# EAGLE design ASM4008 (EAGLE 9.6.2)
DATABASE: ./../../../../../Components/TinyCircuits_Part_Database.txt

## Sheet 1 of 2
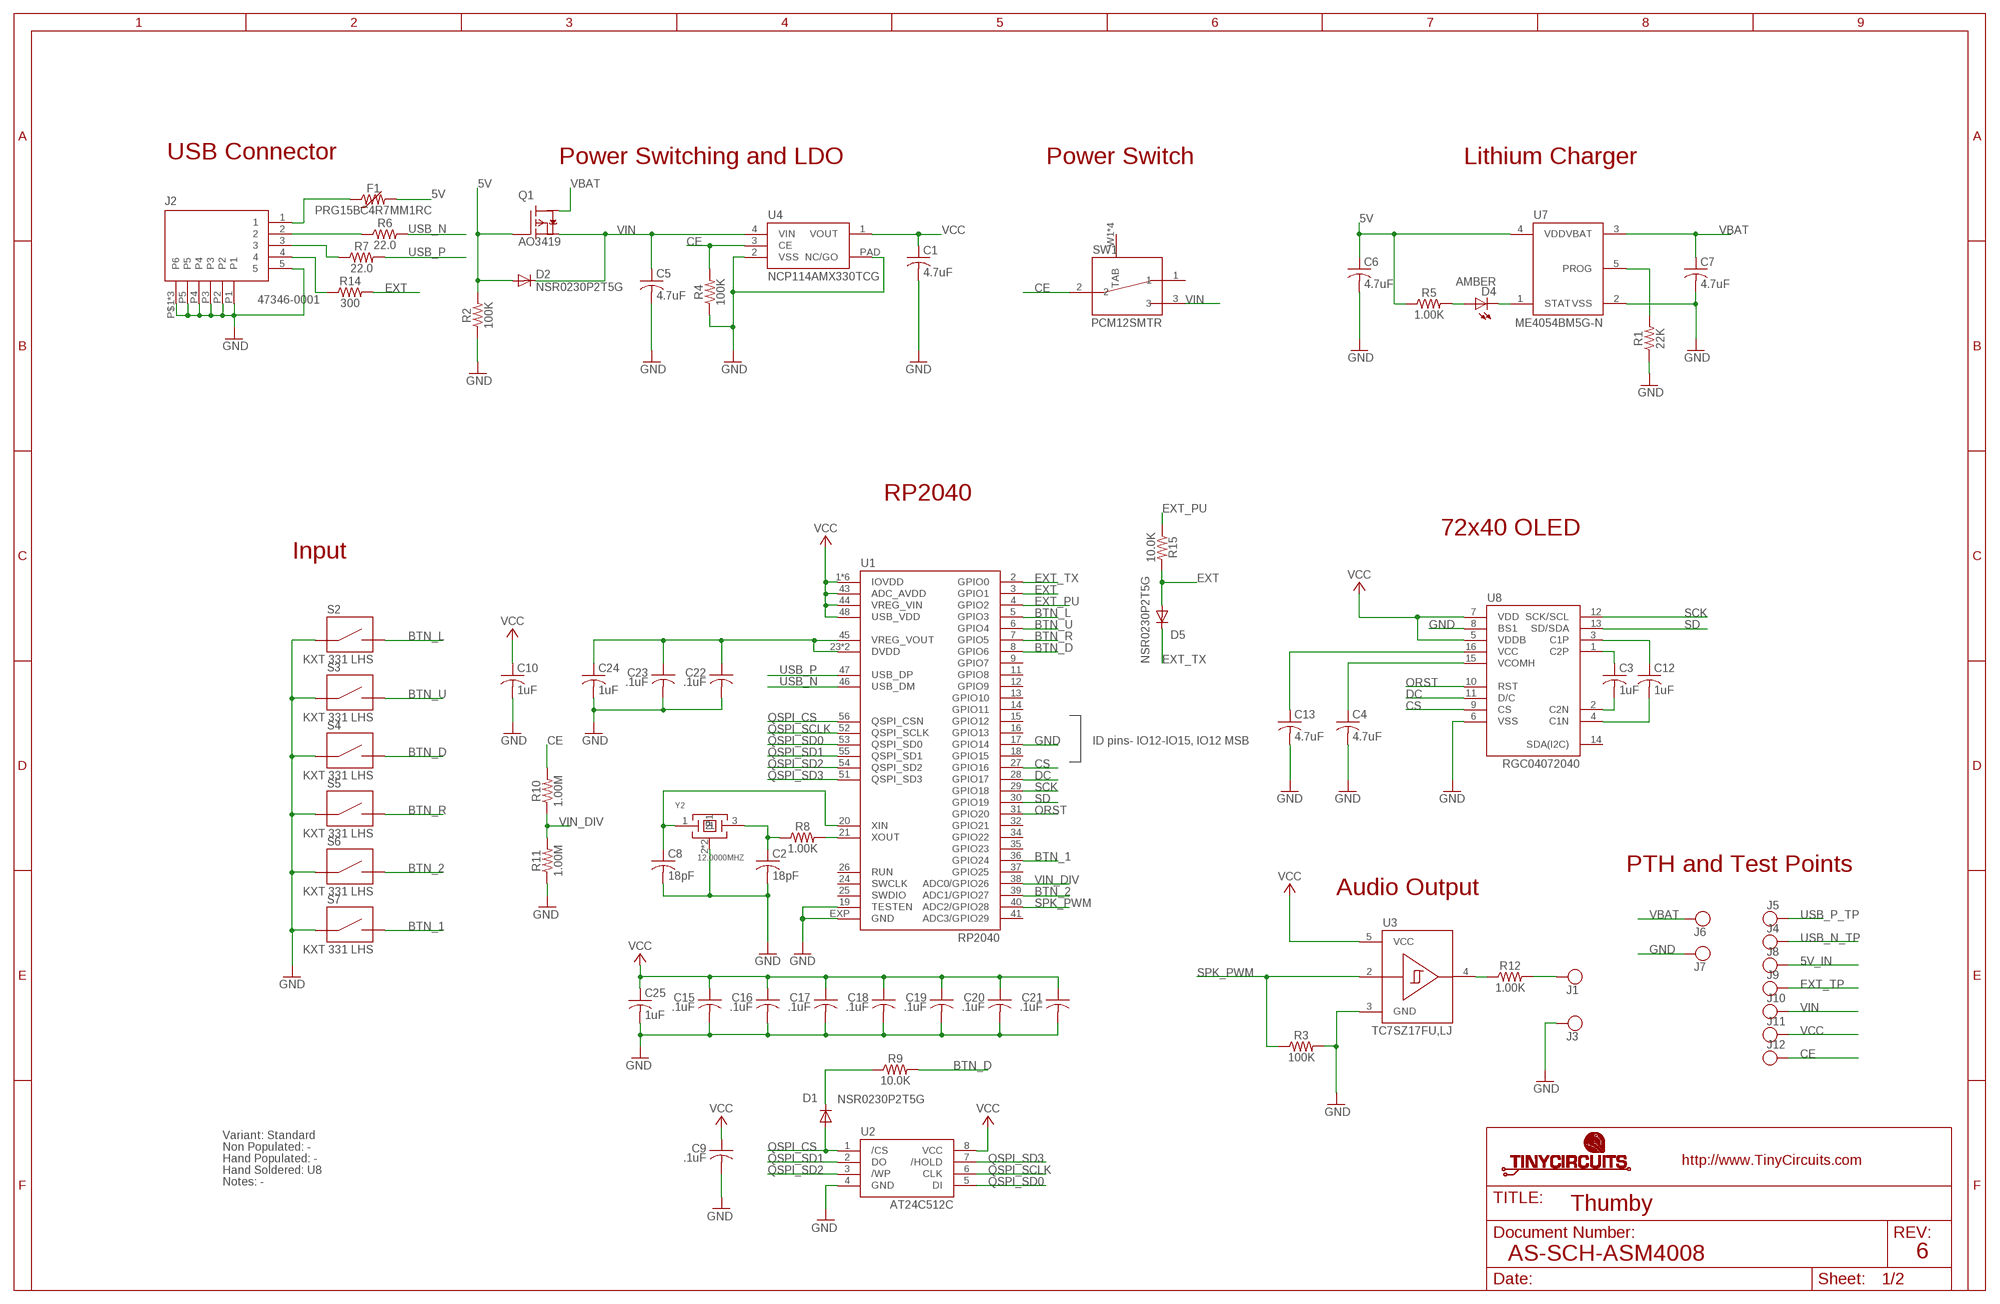
[diagram p0: schematic, sheet 1]

### Parts
C1  4.7uF  AS-ITM-00242  [C0402]
C2  18pF  AS-ITM-00121  [C0402]
C3  1uF  AS-ITM-00347  [C0603]
C4  4.7uF  AS-ITM-00632  [C0603]
C5  4.7uF  AS-ITM-00242  [C0402]
C6  4.7uF  AS-ITM-00242  [C0402]
C7  4.7uF  AS-ITM-00242  [C0402]
C8  18pF  AS-ITM-00121  [C0402]
C9  .1uF  AS-ITM-00008  [C0402]
C10  1uF  AS-ITM-00347  [C0603]
C12  1uF  AS-ITM-00347  [C0603]
C13  4.7uF  AS-ITM-00632  [C0603]
C15  .1uF  AS-ITM-00008  [C0402]
C16  .1uF  AS-ITM-00008  [C0402]
C17  .1uF  AS-ITM-00008  [C0402]
C18  .1uF  AS-ITM-00008  [C0402]
C19  .1uF  AS-ITM-00008  [C0402]
C20  .1uF  AS-ITM-00008  [C0402]
C21  .1uF  AS-ITM-00008  [C0402]
C22  .1uF  AS-ITM-00008  [C0402]
C23  .1uF  AS-ITM-00008  [C0402]
C24  1uF  AS-ITM-00105  [C0402]
C25  1uF  AS-ITM-00105  [C0402]
D1  NSR0230P2T5G  AS-ITM-00633L  [SOD-923L]
D2  NSR0230P2T5G  AS-ITM-00633L  [SOD-923L]
D4  AMBER  AS-ITM-00058  [0402_LED]
D5  NSR0230P2T5G  AS-ITM-00633L  [SOD-923L]
F1  PRG15BC4R7MM1RC  AS-ITM-00642  [0402]
J1  2336713-2  AS-ITM-00635  [2336713-2]
J2  47346-0001  AS-ITM-00629  [MICRO_USB_TABS]
J3  2336713-2  AS-ITM-00635  [2336713-2]
J4  TEST_POINT  [TEST_POINT_1MM]
J5  TEST_POINT  [TEST_POINT_1MM]
J6  PIN_1X.1"  [1X.1"]
J7  PIN_1X.1"  [1X.1"]
J8  TEST_POINT  [TEST_POINT_1MM]
J9  TEST_POINT  [TEST_POINT_1MM]
J10  TEST_POINT  [TEST_POINT_1MM]
J11  TEST_POINT  [TEST_POINT_1MM]
J12  TEST_POINT  [TEST_POINT_1MM]
Q1  AO3419  AS-ITM-00643A  [SOT23A]
R1  22K  AS-ITM-00147  [0402]
R2  100K  AS-ITM-00004  [0402]
R3  100K  AS-ITM-00004  [0402]
R4  100K  AS-ITM-00004  [0402]
R5  1.00K  AS-ITM-00003  [0402]
R6  22.0  AS-ITM-00025  [0402]
R7  22.0  AS-ITM-00025  [0402]
R8  1.00K  AS-ITM-00003  [0402]
R9  10.0K  AS-ITM-00032  [0402]
R10  1.00M  AS-ITM-00005  [0402]
R11  1.00M  AS-ITM-00005  [0402]
R12  1.00K  AS-ITM-00003  [0402]
R14  300  AS-ITM-00016  [0402]
R15  10.0K  AS-ITM-00032  [0402]
S2  KXT 331 LHS  AS-ITM-00640  [KXT_LHS_1]
S3  KXT 331 LHS  AS-ITM-00640  [KXT_LHS_1]
S4  KXT 331 LHS  AS-ITM-00640  [KXT_LHS_1]
S5  KXT 331 LHS  AS-ITM-00640  [KXT_LHS_1]
S6  KXT 331 LHS  AS-ITM-00640  [KXT_LHS_1]
S7  KXT 331 LHS  AS-ITM-00640  [KXT_LHS_1]
SW1  PCM12SMTR  AS-ITM-00220B  [PCM12SMTR_THUMBY]
U1  RP2040  AS-ITM-00611  [QFN56_0.4]
U2  AT24C512C  AS-ITM-00628N  [UDFN-8-NP]
U3  TC7SZ17FU,LJ  AS-ITM-00647NP  [SOT-353-NOPAD]
U4  NCP114AMX330TCG  AS-ITM-00271  [4-UFDN]
U7  ME4054BM5G-N  AS-ITM-00648  [SOT-23]
U8  RGC04072040  AS-ITM-00485  [OLED_042]
Y2  12.0000MHZ  AS-ITM-00638  [CRYSTAL_2.5X2MM_4SMD]

### Nets
5V: C6.1 D2.A F1.2 Q1.B(G) R2.2 R5.1 U7.4(VDD)
5V_IN: F1.1 J2.1 J8.P$1
BTN_1: S7.2 U1.36(GPIO24)
BTN_2: S6.2 U1.39(ADC1/GPIO27)
BTN_D: R9.2 S4.2 U1.8(GPIO6)
BTN_L: S2.2 U1.5(GPIO3)
BTN_R: S5.2 U1.7(GPIO5)
BTN_U: S3.2 U1.6(GPIO4)
CE: J12.P$1 R4.2 R10.2 SW1.2 U4.3(CE)
CS: U1.27(GPIO16) U8.9(CS)
DC: U1.28(GPIO17) U8.11(D/C)
EXT: D5.A R14.2 R15.2 U1.3(GPIO1)
EXT_PU: R15.1 U1.4(GPIO2)
EXT_TP: J2.4 J9.P$1 R14.1
EXT_TX: D5.C U1.2(GPIO0)
GND: C1.2 C2.2 C4.2 C5.2 C6.2 C7.2 C8.2 C9.2 C10.2 C13.2 C15.2 C16.2 C17.2 C18.2 C19.2 C20.2 C21.2 C22.2 C23.2 C24.2 C25.2 J2.5 J2.P1 J2.P2 J2.P3 J2.P4 J2.P5 J2.P6 J2.P$1(P6) J2.P$2(P6) J3.P$1 J7.1 R1.1 R2.1 R3.2 R4.1 R11.1 S2.1 S3.1 S4.1 S5.1 S6.1 S7.1 U1.17(GPIO14) U1.19(TESTEN) U1.EXP(GND) U2.4(GND) U3.3(GND) U4.2(VSS) U4.PAD(NC/GO) U7.2(VSS) U8.6(VSS) U8.8(BS1) Y2.2(P1) Y2.4(P1)
N$1: D4.2(C) U7.1(STAT)
N$2: D4.1(A) R5.2
N$18: R1.2 U7.5(PROG)
N$19: D1.C R9.1
N$21: J1.P$1 R12.2
N$24: C22.1 C23.1 C24.1 U1.23(DVDD) U1.45(VREG_VOUT) U1.50(DVDD)
N$25: R8.2 U1.21(XOUT)
N$27: C8.1 U1.20(XIN) Y2.1
N$28: C2.1 R8.1 Y2.3
N$29: R12.1 U3.4(Y)
N$41: C4.1 U8.15(VCOMH)
N$42: C13.1 U8.16(VCC)
N$43: C3.1 U8.1(C2P)
N$44: C12.1 U8.3(C1P)
N$45: C3.2 U8.2(C2N)
N$46: C12.2 U8.4(C1N)
ORST: U1.31(GPIO20) U8.10(RST)
QSPI_CS: D1.A U1.56(QSPI_CSN) U2.1(/CS)
QSPI_SCLK: U1.52(QSPI_SCLK) U2.6(CLK)
QSPI_SD0: U1.53(QSPI_SD0) U2.5(DI)
QSPI_SD1: U1.55(QSPI_SD1) U2.2(DO)
QSPI_SD2: U1.54(QSPI_SD2) U2.3(/WP)
QSPI_SD3: U1.51(QSPI_SD3) U2.7(/HOLD)
SCK: U1.29(GPIO18) U8.12(SCK/SCL)
SD: U1.30(GPIO19) U8.13(SD/SDA)
SPK_PWM: R3.1 U1.40(ADC2/GPIO28) U3.2(A)
USB_N: R6.2 U1.46(USB_DM)
USB_N_TP: J2.2 J4.P$1 R6.1
USB_P: R7.2 U1.47(USB_DP)
USB_P_TP: J2.3 J5.P$1 R7.1
VBAT: C7.1 J6.1 Q1.C(D) U7.3(VBAT)
VCC: C1.1 C9.1 C10.1 C15.1 C16.1 C17.1 C18.1 C19.1 C20.1 C21.1 C25.1 J11.P$1 U1.1(IOVDD) U1.10(IOVDD) U1.22(IOVDD) U1.33(IOVDD) U1.42(IOVDD) U1.43(ADC_AVDD) U1.44(VREG_VIN) U1.48(USB_VDD) U1.49(IOVDD) U2.8(VCC) U3.5(VCC) U4.1(VOUT) U8.5(VDDB) U8.7(VDD)
VIN: C5.1 D2.C J10.P$1 Q1.E(S) SW1.3 U4.4(VIN)
VIN_DIV: R10.1 R11.2 U1.38(ADC0/GPIO26)
Unconnected: SW1.1 SW1.W1(TAB) SW1.W2(TAB) SW1.W3(TAB) SW1.W4(TAB) U1.9(GPIO7) U1.11(GPIO8) U1.12(GPIO9) U1.13(GPIO10) U1.14(GPIO11) U1.15(GPIO12) U1.16(GPIO13) U1.18(GPIO15) U1.24(SWCLK) U1.25(SWDIO) U1.26(RUN) U1.32(GPIO21) U1.34(GPIO22) U1.35(GPIO23) U1.37(GPIO25) U1.41(ADC3/GPIO29) U8.14(SDA(I2C))

### Notes on the sheet
- USB Connector | Power Switching and LDO | Power Switch | Lithium Charger
- RP2040
- 72x40 OLED
- Input
- ID pins- IO12-IO15, IO12 MSB
- PTH and Test Points
- Audio Output
- Variant: Standard
- Non Populated: -
- Hand Populated: -
- Hand Soldered: U8
- Notes: -
- Thumby
- AS-SCH-ASM4008 | 6

## Sheet 2 of 2

## Library data of the parts
C1 C5-C7 = tinycircuits:AS-ITM-00242: CAP CER 4.7UF 6.3V 20% X5R 0402; PARTNO: AS-ITM-00242
C2 C8 = tinycircuits:AS-ITM-00121: CAP CER 18PF 50V 5% NP0 0402; PARTNO: AS-ITM-00121
C3 C10 C12 = tinycircuits:AS-ITM-00347: CAP CER 1UF 16V X7R 0603; PARTNO: AS-ITM-00347
C4 C13 = tinycircuits:AS-ITM-00632: CAP CER 4.7UF 25V X5R 0603; PARTNO: AS-ITM-00632; VALUE: 1uF
C9 C15-C23 = tinycircuits:AS-ITM-00008: CAP CER 0.1UF 16V 10% X5R 0402; PARTNO: AS-ITM-00008; VALUE: 0.1uF
C24 C25 = tinycircuits:AS-ITM-00105: CAP CER 1UF 6.3V 10% X5R 0402; PARTNO: AS-ITM-00105
D1 D2 D5 = tinycircuits:AS-ITM-00633: DIODE SCHOTTKY 30V 200MA SOD923; PARTNO: AS-ITM-00633; PNPROTATION: 0
D4 = tinycircuits:AS-ITM-00058: LED 0402 AMBER WTR CLR SMD; PARTNO: AS-ITM-00058; PNPROTATION: 0; VALUE: RED
F1 = tinycircuits:AS-ITM-00642: PTC RESET FUSE 9V 91MA 0402; PARTNO: AS-ITM-00642; PNPROTATION: 0
J1 J3 = tinycircuits:AS-ITM-00635: SPRING FINGER 1.45H; PARTNO: AS-ITM-00635; PNPROTATION: 180
J2 = tinycircuits:AS-ITM-00629: CONN RCPT 5POS MICRO USB R/A; PARTNO: AS-ITM-00629; PNPROTATION: 0
J4 J5 J8-J12 = tinycircuits:TEST_POINT: Test point, no drill
J6 J7 = tinycircuits:PIN_1X.1": 1 Pin 0.100" Header
Q1 = tinycircuits:AS-ITM-00643: MOSFET P-CH 20V 3.5A SOT23-3L; PARTNO: AS-ITM-00643; PNPROTATION: 0
R1 = tinycircuits:AS-ITM-00147: RES 22K OHM 1/16W 5% 0402 SMD; PARTNO: AS-ITM-00147
R2-R4 = tinycircuits:AS-ITM-00004: RES 100K OHM 1/16W 1% 0402; PARTNO: AS-ITM-00004
R5 R8 R12 = tinycircuits:AS-ITM-00003: RES 1.00K OHM 1/16W 1% 0402; PARTNO: AS-ITM-00003
R6 R7 = tinycircuits:AS-ITM-00025: RES 22.0 OHM 1/16W 1% 0402; PARTNO: AS-ITM-00025
R9 R15 = tinycircuits:AS-ITM-00032: RES 10.0K OHM 1/16W 1% 0402 SMD; PARTNO: AS-ITM-00032
R10 R11 = tinycircuits:AS-ITM-00005: RES 1.00M OHM 1/16W 1% 0402; PARTNO: AS-ITM-00005
R14 = tinycircuits:AS-ITM-00016: RES 300 OHM 1/16W 1% 0402; PARTNO: AS-ITM-00016
S2-S7 = tinycircuits:AS-ITM-00640: SWITCH TACTILE SPST-NO 0.05A 12V; PARTNO: AS-ITM-00640; PNPROTATION: 90
SW1 = tinycircuits:AS-ITM-00220: SW SLIDE SP2T 6VDC 0.3A SMT; PARTNO: AS-ITM-00220
U1 = tinycircuits:AS-ITM-00611; PARTNO: AS-ITM-00611; PNPROTATION: 270
U2 = tinycircuits:AS-ITM-00628: IC FLASH 16MBIT SPI 133MHZ 8USON; PARTNO: AS-ITM-00628
U3 = tinycircuits:AS-ITM-00647: IC BUFFER NON-INVERT 5.5V USV; PARTNO: AS-ITM-00647; PNPROTATION: 0; VALUE: 74LVC1G17S
U4 = tinycircuits:AS-ITM-00271: IC REG LDO 3.3V 0.3A 4UDFN; PARTNO: AS-ITM-00271; PNPROTATION: 270
U7 = tinycircuits:AS-ITM-00648: IC CONTROLLER LI-ION 4.2V SOT23-5; PARTNO: AS-ITM-00648; PNPROTATION: 270
U8 = tinycircuits:AS-ITM-00485: OLED MONOCHROME 0.42" 72x40; PARTNO: AS-ITM-00485
Y2 = tinycircuits:AS-ITM-00638: CRYSTAL 12.0000MHZ 12PF SMD; PARTNO: AS-ITM-00638; PNPROTATION: 0

## Board
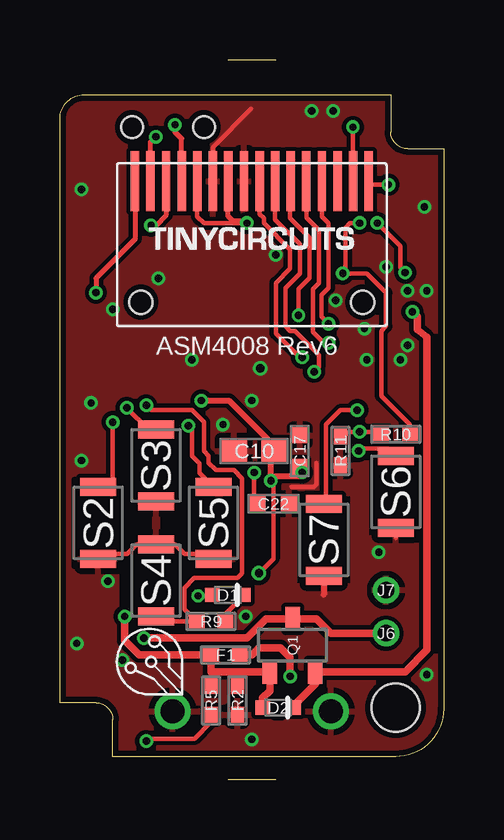
[diagram p1: board, top side]
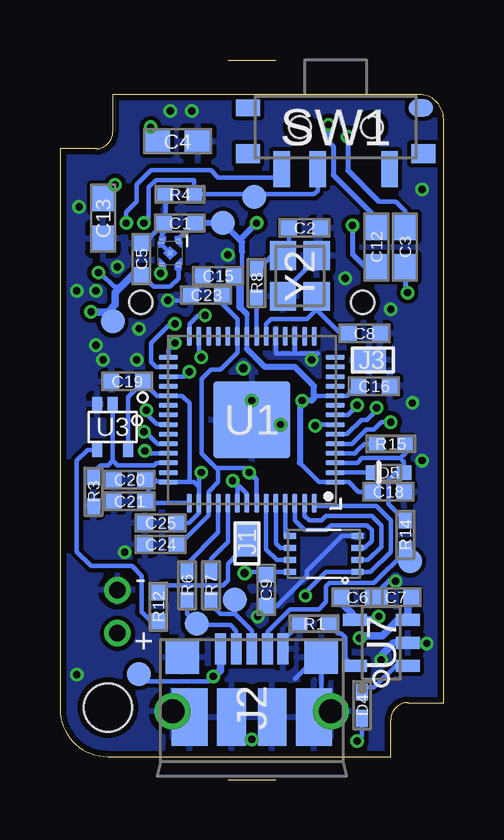
[diagram p2: board, bottom side, seen from below]

Size 16 x 30 mm. Coordinates in mm from the lower left corner, seen from the top.
Outline: 9,0 7,0
Outline: 9,30 7,30
Outline: 0,27.55 arc-90 1,28.55 13.8,28.55 13.8,27 arc90 14.5,26.3 16,26.3 16,2.95 arc-90 14,0.95 2.2,0.95 2.2,2.5 arc90 1.5,3.2 0,3.2 0,27.55
Copper layers (1*16): Top 0.035mm / dielectric 1.5mm / Bottom 0.035mm
Design rules "default *": minimum track width 7mil, minimum drill 12mil, track to track 7mil, track to pad 7mil, pad to pad 7mil, via to via 7mil, smd to smd 7mil, copper to edge 10mil, drill to drill 8mil, minimum pad ring 8mil, minimum via ring 5mil, stop-mask expansion 4mil, vias tented up to drill 25mil, thermal gap 10mil
Holes 2 mm at 14,3
tKeepout: area 11.5,0.5 to 16.5,5.5
tRestrict: area 9.9,8.2 to 12.1,11.8; area 12.9,10.2 to 15.1,13.8; 23 lines
bRestrict: 5 lines

### Footprints (pad centres in the part's own frame; a part is rotated, then mirrored left to right if it is on the bottom)
C0402 = smd 0.65 x 0.6: 1 -0.65,0; 2 0.65,0
C0603 = smd 1.1 x 1: 1 -0.85,0; 2 0.85,0
SOD-923L = smd 0.6 x 0.6: A 0.65,0; C -0.65,0
0402_LED = smd 0.7 x 0.5: 1 -0.55,0; 2 0.55,0
0402 = smd 0.65 x 0.55: 1 -0.6,0; 2 0.6,0
2336713-2 = smd 1.4 x 1: P$1 0,0
MICRO_USB_TABS = smd 0.45 x 1.3: 1 1.3,-2.45; 2 0.65,-2.45; 3 0,-2.45; 4 -0.65,-2.45; 5 -1.3,-2.45 | smd 1.4 x 1.4: P1 -2.9,-2.1; P2 2.9,-2.1 | smd 1.5 x 2.4: P3 2.6,0.4; P4 -2.6,0.4 | smd 1.2 x 2.4: P5 0.85,0.4; P6 -0.85,0.4 | drill 1 pad 1.5: P$1 -3.3,0.15 | drill 1: P$2 3.3,0.15
TEST_POINT_1MM = smd 1 x 1: P$1 0,0
1X.1" = drill 0.7 pad 1.016: 1 0,0
SOT23A = smd 0.6 x 1: B -0.95,-1.1; C 0,1.1; E 0.95,-1.1
KXT_LHS_1 = smd 1.5 x 0.75: 1 0,1.5; 2 0,-1.5
PCM12SMTR_THUMBY = smd 0.7 x 1.5: 1 -2.25,1.75; 2 0.75,1.75; 3 2.25,1.75 | smd 1 x 0.8: W1 -3.65,1.1; W4 3.65,1.1 | smd 1 x 0.7: W2 -3.55,-0.8; W3 3.65,-0.8 | hole 0.9: 1.5,0; -1.5,0
QFN56_0.4 = smd 0.8 x 0.203: 1 -3.475,2.6; 2 -3.475,2.2; 3 -3.475,1.8; 4 -3.475,1.4; 5 -3.475,1; 6 -3.475,0.6; 7 -3.475,0.2; 8 -3.475,-0.2; 9 -3.475,-0.6; 10 -3.475,-1; 11 -3.475,-1.4; 12 -3.475,-1.8; 13 -3.475,-2.2; 14 -3.475,-2.6; 29 3.475,-2.6; 30 3.475,-2.2; 31 3.475,-1.8; 32 3.475,-1.4; 33 3.475,-1; 34 3.475,-0.6; 35 3.475,-0.2; 36 3.475,0.2; 37 3.475,0.6; 38 3.475,1; 39 3.475,1.4; 40 3.475,1.8; 41 3.475,2.2; 42 3.475,2.6 | smd 0.203 x 0.8: 15 -2.6,-3.475; 16 -2.2,-3.475; 17 -1.8,-3.475; 18 -1.4,-3.475; 19 -1,-3.475; 20 -0.6,-3.475; 21 -0.2,-3.475; 22 0.2,-3.475; 23 0.6,-3.475; 24 1,-3.475; 25 1.4,-3.475; 26 1.8,-3.475; 27 2.2,-3.475; 28 2.6,-3.475; 43 2.6,3.475; 44 2.2,3.475; 45 1.8,3.475; 46 1.4,3.475; 47 1,3.475; 48 0.6,3.475; 49 0.2,3.475; 50 -0.2,3.475; 51 -0.6,3.475; 52 -1,3.475; 53 -1.4,3.475; 54 -1.8,3.475; 55 -2.2,3.475; 56 -2.6,3.475 | smd 3.2 x 3.2: EXP 0,0
UDFN-8-NP = smd 0.5 x 0.25: 1 -1.4,0.75; 2 -1.4,0.25; 3 -1.4,-0.25; 4 -1.4,-0.75; 5 1.4,-0.75; 6 1.4,-0.25; 7 1.4,0.25; 8 1.4,0.75
SOT-353-NOPAD = smd 0.42 x 0.6: 2 0,-0.95; 3 0.65,-0.95; 4 0.65,0.95; 5 -0.65,0.95
4-UFDN = smd 0.21 x 0.21: 1 -0.35,-0.5; 2 0.35,-0.5; 3 0.35,0.5; 4 -0.35,0.5; PAD 0,0
SOT-23 = smd 0.5 x 1: 1 -0.95,-1.1; 2 0,-1.1; 3 0.95,-1.1; 4 0.95,1.1; 5 -0.95,1.1
OLED_042 = smd 0.35 x 2.5: 1 4.875,-2.65; 2 4.225,-2.65; 3 3.575,-2.65; 4 2.925,-2.65; 5 2.275,-2.65; 6 1.625,-2.65; 7 0.975,-2.65; 8 0.325,-2.65; 9 -0.325,-2.65; 10 -0.975,-2.65; 11 -1.625,-2.65; 12 -2.275,-2.65; 13 -2.925,-2.65; 14 -3.575,-2.65; 15 -4.225,-2.65; 16 -4.875,-2.65 | hole 0.95: 4.625,2.4; -4.625,2.4
CRYSTAL_2.5X2MM_4SMD = smd 1.2 x 1.1: 1 -0.85,-0.7; 2 0.85,-0.7; 3 0.85,0.7; 4 -0.85,0.7

### Placement (x,y rotation side)
C1  11,23.2 180 bottom
C2  5.8,23 0 bottom
C3  1.6,22.2 90 bottom
C4  11.1,26.6 0 bottom
C5  12.6,21.7 90 bottom
C6  3.6,7.6 0 bottom
C7  2,7.6 180 bottom
C8  3.3,18.6 0 bottom
C9  7.4,7.9 270 bottom
C10  8.1,13.7 180 top
C12  2.8,22.2 90 bottom
C13  14.2,23.4 270 bottom
C15  9.4,21 180 bottom
C16  2.9,16.4 0 bottom
C17  10,13.7 90 top
C18  2.3,12 0 bottom
C19  13.2,16.6 180 bottom
C20  13.1,12.5 180 bottom
C21  13.1,11.6 180 bottom
C22  8.9,11.5 0 top
C23  9.9,20.2 180 bottom
C24  11.8,9.8 180 bottom
C25  11.8,10.7 180 bottom
D1  7,7.7 180 top
D2  9.1,3 180 top
D4  3.4,3.1 90 bottom
D5  2.3,12.8 0 bottom
F1  6.9,5.2 180 top
J1  8.2,10 90 bottom
J2  8,3 180 bottom
J3  3.1,17.5 180 bottom
J4  10.3,6.5 0 bottom
J5  8.7,7.5 0 bottom
J6  13.6,6.1 0 top
J7  13.6,7.9 0 top
J8  12.7,4.4 0 bottom
J9  1.4,9.1 0 bottom
J10  13.8,19.1 0 bottom
J11  9.2,23.2 0 bottom
J12  7.9,24.3 0 bottom
Q1  9.7,5.6 0 top
R1  5.4,6.5 0 bottom
R2  7.4,3.3 90 top
R3  14.6,12 270 bottom
R4  11,24.4 0 bottom
R5  6.3,3.3 270 top
R6  10.7,8.1 90 bottom
R7  9.7,8.1 90 bottom
R8  7.8,20.7 270 bottom
R9  6.3,6.6 180 top
R10  14,14.4 0 top
R11  11.7,13.7 90 top
R12  11.9,7.2 90 bottom
R14  1.6,10.2 90 bottom
R15  2.2,14 0 bottom
S2  1.6,10.7 180 top
S3  4,13.1 180 top
S4  4,8.3 0 top
S5  6.4,10.7 180 top
S6  14,12 180 top
S7  11,10 180 top
SW1  4.5,27.2 180 bottom
U1  8,15 180 bottom
U2  5,9.4 180 bottom
U3  13.8,14.7 180 bottom
U4  11.4,21.95 180 bottom
U7  2.6,5.7 90 bottom
U8  8,22.3 180 top
U$1  [DOCFIELD-TINYCIRCUITS-PCB]  33,-9 0 top  (outside the outline)
Y2  6,21 90 bottom

### Tracks (layer width: path | path; a pad name or v marks a point on that pad's centre or on a via)
5V  (via drill 0.3)
  Top 0.178: R2.2 7.4,4.5 | R5.1 6.3,4.5
  Top 0.305: v2.7,6.8 2.7,5.8 3.3,5.2 F1.2 6.3,4.5 7.4,4.5 Q1.B 8.75,3.7 8.45,3.4 D2.A
  Bottom 0.178: 3.75,6.6 U7.4 | C6.1 4.25,7.35
  Bottom 0.305: 4.25,7.35 3.8,6.9 4.05,6.65 U7.4 2.85,6.65 v2.7,6.8
5V_IN  (via drill 0.3)
  Top 0.305: v9.6,4.3 9.6,5.1 9.2,5.5 8.3,5.5 8,5.2 F1.1
  Bottom 0.178: v9.6,4.3 9.8,4.1 12.4,4.1 J8.P$1
  Bottom 0.305: J2.1 9.3,4.55 9.55,4.3 v9.6,4.3
BTN_1  (via drill 0.3)
  Top 0.178: v12.4,15.4 11.7,15.4 11.1,14.8 11.1,11.6 S7.2 10.8,11.7
  Bottom 0.178: U1.36 11.51,14.83 11.97,14.83 12.44,15.31 12.44,15.36 v12.4,15.4
BTN_2  (via drill 0.3)
  Top 0.178: v12.45,13.7 12.55,13.8 13.7,13.8 S6.2
  Bottom 0.178: v12.45,13.7 12.3,13.7 12.2,13.6 U1.39
BTN_D  (via drill 0.3)
  Top 0.178: v3.6,15.6 3.8,15.4 5.5,15.4 6,14.9 6,13.7 6.2,13.5 6.2,13.2 6.5,12.9 7.25,12.9 7.6,12.55 7.6,8.6 7.4,8.4 5.6,8.4 5.2,8 5.2,7.1 R9.2 4.2,6.6 S4.2
  Bottom 0.178: U1.8 4,15.2 v3.6,15.6
BTN_L  (via drill 0.3)
  Top 0.178: S2.2 2,12.4 2.2,12.4 v2.2,14.9
  Bottom 0.178: U1.5 3.82,14 3.23,14.6 2.9,14.6 2.6,14.9 v2.2,14.9
BTN_R  (via drill 0.3)
  Top 0.178: v5.35,14.75 5.5,14.6 5.5,13.5 5.82,13.18 5.82,12.78 S5.2
  Bottom 0.178: v5.35,14.75 5.3,14.8 U1.7
BTN_U  (via drill 0.3)
  Top 0.178: 3.4,14.6 S3.2 3.69,14.6 v2.79,15.5
  Bottom 0.178: U1.6 4.02,14.4 3.43,15 3.19,15 2.79,15.4 v2.79,15.5
CE  (via drill 0.3)
  Top 0.178: R10.2 14.6,14.8 13.4,16 13.4,18.7 13.6,18.9 13.6,20.3 12.8,21.1 v11.8,21.1 11.9,21.2 11.9,23 12.1,23.2 v12.5,23.2
  Bottom 0.178: U4.3 11.75,21.19 v11.8,21.1 | SW1.2 5.25,24.55 5.4,24.4 7.9,24.4 | 7.9,24.4 R4.2 10.4,25 12,25 12.3,24.7 12.3,23.4 v12.5,23.2 | J12.P$1 7.9,24.4
CS  (via drill 0.3)
  Top 0.178: v10.1,17.6 10,17.6 9,18.6 9,20.7 9.6,21.3 9.6,22.1 8.5,23.2 8.5,23.4 8.32,23.58 U8.9
  Bottom 0.178: U1.27 10.2,17.7 v10.1,17.6
DC  (via drill 0.3)
  Top 0.178: v9.95,19.35 9.95,20.45 10.4,20.9 10.4,22.6 9.6,23.4 9.6,24.92 U8.11
  Bottom 0.178: U1.28 10.6,19 10.25,19.35 v9.95,19.35
EXT
  Bottom 0.178: R14.2 2.3,11.5 2.3,12.5 2,12.8 D5.A 1.65,13.25 1.8,13.4 | U1.3 3.6,13.2 3.4,13.4 1.8,13.4 | 1.8,13.4 1.6,13.6 R15.2
EXT_PU
  Bottom 0.178: U1.4 3.7,13.6 3.55,13.76 3.54,13.76 3.3,14 R15.1
EXT_TP
  Bottom 0.178: J2.4 7.35,6.15 6.4,7.1 5.2,7.1 4.9,7.4 4.9,8.05 4.75,8.2 2.9,8.2 1.6,9.5 R14.1 1.4,9.4 J9.P$1
EXT_TX
  Bottom 0.178: U1.2 D5.C
GND  (via drill 0.3, 0.35)
  Top 0.178: U8.6 6.38,26.38 7.98,27.98 | S6.1 14,10.07 | S2.1 2,9.4 2.8,9.4 3.2,9.8 S4.1 4.8,9.8 5.2,9.4 6,9.4 S5.1 | 9.65,12.2 10.6,12.2 10.7,12.3 10.7,13.2
  Top 0.254: S7.1 11,7.7
  Bottom 0.178: U2.4 4.25,10.15 5.7,8.7 5.7,8.5 6.95,7.25 C9.2 7.55,7.25 7.75,7.05 v7.75,6.8 | Y2.2 5.58,21.57 5.58,21.44 6.7,20.32 Y2.4 | U1.19 7,17.76 6.2,17.76 | 6.2,17.76 5.24,17.76 | v2,8.27 2.27,8.27 C6.2 | 6.2,4.2 5.3,5.1 J2.P1 5.1,3.25 J2.P$1 | 10.9,3.25 J2.P$2 | J2.5 6.7,5.8 R1.1 | C5.2 12.5,22.35 11.9,22.95 11.75,22.95 11.75,22.75 | 11.75,22.75 11.6,22.9 11.6,23.15 C1.2 11.6,23.25 R4.1 | 11.75,22.75 U4.2 11.85,22.35 11.8,22.35 U4.PAD | v11.5,19.98 10.77,19.98 C23.2 10.05,20.7 C15.2 | U1.17 6.2,17.76
  Bottom 0.305: U7.2 2.07,5.7 2.6,5.18 v2.6,4.97
  other vias: 15.3,20.38 11.4,27.88 15.3,4.38 0.7,5.68 15.2,23.88 1.3,15.7 10.5,27.88 4.1,20.9 0.9,24.6 8.35,17.15 5.5,17.5 13.6,21.38 14.5,20.38 8,15.8 14.2,17.5 9,21.88 8,1.68 0.9,13.3 2.2,19.6 13.3,9.48 12.7,18.8 14.5,18.1 12.8,17.5 6.8,14.8
  pour Top: 0,28.5 16,28.5 16,1 0,1
  pour Bottom: 0,28.5 16,28.5 16,1 0,1
N$1
  Bottom 0.178: U7.1 2,4.75 2.9,3.85 3.2,3.85 D4.2
N$2  (via drill 0.3)
  Top 0.178: v3.6,1.61 3.7,1.71 5.61,1.71 6.3,2.4 R5.2
  Bottom 0.178: D4.1 3.4,1.8 v3.6,1.61
N$18
  Bottom 0.178: U7.5 3.8,4.75 4.1,5.05 4.1,5.93 4.27,6.1 4.4,6.1 R1.2
N$19
  Top 0.178: D1.C 7.65,7.65 7.16,7.16 7.16,7.15 6.9,6.9 R9.1
N$21
  Bottom 0.178: J1.P$1 8.6,9.6 8.6,9.4 9,9 9,8.3 9.2,8.1 11.7,8.1 11.9,7.9 R12.2
N$24  (via drill 0.3)
  Top 0.178: v8.1,12.8 8.1,11.65 C22.1
  Bottom 0.178: v8.1,12.8 8.07,12.8 7.8,12.52 U1.50 7.8,12.5 8.3,13 9.4,13 | C24.1 11.01,9.8 9.8,11.01 U1.45 9.8,12 9.4,12.4 9.4,13 | C23.1 9.25,19.85 8.6,19.2 U1.23 8.6,17.8 9.3,17.1 9.7,17.1 10.1,16.7 10.1,13.6 9.5,13 9.4,13
N$25
  Bottom 0.178: U1.21 R8.2
N$27
  Bottom 0.178: U1.20 7.4,19 7.2,19.2 5.7,19.2 5.3,19.6 | 5.3,19.6 Y2.1 | C8.1 4.3,18.6 5.3,19.6
N$28
  Bottom 0.178: R8.1 7.7,21.3 7.15,21.85 Y2.3 6.45,22.1 C2.1
N$29
  Bottom 0.178: U3.4 14.85,13.75 15.3,13.3 15.3,9.5 14.7,8.9 13,8.9 12.6,8.5 12.6,7 12.2,6.6 R12.1
N$41  (via drill 0.3)
  Top 0.178: v12.22,27.2 v12.23,27.19 U8.15
  Bottom 0.178: v12.22,27.2 12.22,26.6 C4.1
N$42  (via drill 0.3)
  Top 0.178: v13.7,24.8 13.02,24.8 U8.16
  Bottom 0.178: C13.1 14.2,24.3 v13.7,24.8
N$43  (via drill 0.3)
  Top 0.2: U8.1 3.12,22.52 1.5,20.9 v1.5,20.3
  Bottom 0.2: v1.5,20.3 1.6,20.4 C3.1
N$44  (via drill 0.3)
  Top 0.2: U8.3 4.43,23.52 4,23.1 v3.8,23.1
  Bottom 0.2: v3.8,23.1 3.8,21.9 3.25,21.35 C12.1
N$45  (via drill 0.3)
  Top 0.2: U8.2 3.77,26.58 v4,26.8
  Bottom 0.178: C3.2 1.6,23.7 2,24.1 2.7,24.1
  Bottom 0.2: v4,26.8 4,25.4 2.7,24.1
N$46  (via drill 0.3)
  Top 0.2: U8.4 5.07,26.73 4.8,27 v4.8,27.3
  Bottom 0.2: v4.8,27.3 4.8,26.6 4.6,26.4 4.6,25.2 2.8,23.4 C12.2
ORST  (via drill 0.3)
  Top 0.178: U8.10 8.98,23.34 10,22.32 10,21.1 9.4,20.5 9.4,18.9 9.6,18.7 9.8,18.7 10.8,17.7 10.8,17.2 v10.6,17
  Bottom 0.178: U1.31 10.8,16.8 v10.6,17
QSPI_CS  (via drill 0.3)
  Top 0.178: D1.A 6.3,7.66 v5.76,7.66
  Bottom 0.178: U1.56 5.27,11.4 2.8,11.4 2.2,10.8 2.2,9.5 3.05,8.65 U2.1 4.9,8.65 5.76,7.79 v5.76,7.66
QSPI_SCLK
  Bottom 0.178: U2.6 6.8,9.65 7,9.85 U1.52
QSPI_SD0
  Bottom 0.178: U1.53 6.6,10.15 U2.5
QSPI_SD1
  Bottom 0.178: U1.55 5.8,11 5.6,10.8 5.1,10.8 4.9,11 3,11 2.6,10.6 2.6,9.7 3.15,9.15 U2.2
QSPI_SD2
  Bottom 0.178: U1.54 6.2,10.8 5.8,10.4 4.9,10.4 4.7,10.6 3.2,10.6 3,10.4 3,9.95 3.3,9.65 U2.3
QSPI_SD3
  Bottom 0.178: U1.51 7.4,9.6 6.95,9.15 U2.7
SCK  (via drill 0.3)
  Top 0.178: U8.12 10.27,23.42 10.8,22.9 10.8,20.7 10.54,20.44 10.54,18.66 11,18.2 v11.2,18.2
  Bottom 0.178: U1.29 11.48,17.93 v11.2,18.2
SD  (via drill 0.3)
  Top 0.178: U8.13 10.93,23.48 11.2,23.2 11.2,20.5 10.9,20.2 10.9,19.3 v11.2,19
  Bottom 0.178: U1.30 12,17.2 12.2,17.4 12.2,18.2 11.4,19 v11.2,19
SPK_PWM
  Bottom 0.178: U1.40 11.98,13.2 12.07,13.1 13.6,13.1 13.8,13.3 | R3.1 14.6,12.8 14.3,13.1 14,13.1 13.8,13.3 | U3.2 13.8,13.3
USB_N
  Bottom 0.178: U1.46 9.4,10.3 10.7,9 R6.2
USB_N_TP
  Bottom 0.178: J2.2 8.65,6.2 8.89,6.44 10.24,6.44 J4.P$1 10.35,6.55 10.7,6.9 R6.1
USB_P
  Bottom 0.178: U1.47 9,9.9 9.7,9.2 R7.2
USB_P_TP
  Bottom 0.178: J2.3 8,6.2 8.7,6.9 | R7.1 9.7,7.3 9.3,6.9 8.7,6.9 | J5.P$1 8.7,6.9
VBAT  (via drill 0.3)
  Top 0.305: v3.5,5.9 7.8,5.9 8.6,6.7 Q1.C 10.7,6.7 11.3,6.1 J6.1
  Bottom 0.305: C7.1 1.5,7.33 U7.3 1.9,6.65 2.55,6 3.4,6 v3.5,5.9
VCC  (via drill 0.3, 0.35)
  Top 0.178: v7.8,23.2 6,23.2 5.73,23.48 U8.5 | v8.8,12.45 8.9,12.35 8.9,9.2 v8.3,8.6 | C17.1 10.1,12.95 v10.1,12.8
  Top 0.2: U8.7 7,24.92 7,23.5 7.2,23.3 7.7,23.3 v7.8,23.2 7.68,23.33 | 5.7,24.98 U8.5
  Top 0.254: v10.1,12.8 9.95,12.65 9,12.65 v8.8,12.45 8.8,13.65 8.75,13.7 C10.1 8.95,13.9 7.05,15.8 v5.9,15.8
  Bottom 0.178: 10.2,12.2 U1.44 10.2,11.11 10.61,10.7 C25.1 | v10.1,12.8 10.2,12.7 10.2,12.2 | 10.2,12.2 10.4,12.4 10.6,12.4 | 10.6,12.4 U1.42 11.51,12.43 11.97,12.43 12.14,12.6 12.3,12.6 12.3,12.5 | U1.43 12.38,11.52 C21.1 12.3,11.75 12.3,12.5 | 12.3,12.5 C20.1 | 8.2,19.4 U1.22 8.2,17.95 | 8.75,20.85 C15.1 | 6,13.2 5.2,12.4 U1.1 3.95,12.4 3.55,12 C18.1 | 5.4,15.9 5.3,16 U1.10 4.02,16 3.82,16.2 3.55,16.2 C16.1 | U1.48 8.6,12.2 | 8.6,12.2 8.6,12.3 8.2,11.9 U1.49 | v8.8,12.45 8.8,12.4 8.6,12.2 | 10.6,12.4 10.6,15.7 10.9,16 U1.33 11.95,16 C19.1 12.55,16.55 13.15,15.95 U3.5 | 8.93,20.82 C15.1 | C15.1 8.4,21.35 8.4,22 8.4,22.1 | U4.1 11.05,22.55 10.4,23.2 C1.1 | v8.3,8.6 8.25,8.65 7.4,8.65 | U2.8 7.4,8.65 | C9.1 7.4,8.65 | J11.P$1 9.15,23.15
  Bottom 0.254: 8.2,19.4 8.5,19.7 | 6,13.2 6,15.7 v5.9,15.8 5.5,15.8 5.4,15.9 5.4,16.4 6.2,17.2 7.45,17.2 8.2,17.95 | 8.4,22 8.4,22.4 8.45,22.45 | 9.15,23.15 8.45,22.45 | J11.P$1 C1.1 | v7.8,23.2 8.45,22.55 8.45,22.45
  Bottom 0.305: 8.5,19.7 8.5,20.6 8.75,20.85
VIN  (via drill 0.3)
  Top 0.178: v13.24,23.2 14.2,22.24 14.2,21.33 v14.4,21.13
  Top 0.305: v14.7,19.5 14.9,19.3 14.9,18.76 15.3,18.44 15.3,5.4 14.4,4.5 Q1.E 10.65,4 9.75,3.1 D2.C
  Bottom 0.178: C5.1 12.09,20.54 11.4,20.54 11.05,20.89 U4.4 | 13.45,20.55 13.75,20.55 14.3,21.1 14.37,21.1 v14.4,21.13 | v13.24,23.2 13.24,23.66 12.8,24.1 12.8,24.8 12.2,25.4 9.7,25.4 9.4,25.1 6.9,25.1 6.9,25.3 SW1.3 | J10.P$1 13.8,19.3 14,19.5
  Bottom 0.305: C5.1 12.95,21.05 13.45,20.55 13.7,20.3 13.7,19.8 14,19.5 v14.7,19.5
VIN_DIV  (via drill 0.3)
  Top 0.178: R10.1 13.3,14.5 v12.5,14.5 12.05,14.5 11.85,14.3 R11.2
  Bottom 0.178: U1.38 11.94,14 12.44,14.5 v12.5,14.5

### Text on the board
tPlace: ASM4008 Rev6
bPlace: - | +
Document: FABRICATION DRAWING | NOTES: | 1. PRINTED CIRCUIT BOARD MADE FROM NEMA GRADE FR-4 EPOXY LAMINATE | WITH 1 OUNCE COPPER PLATING AND .024 THICKNESS. | 2. ALL DIMENSIONS ARE GIVEN IN INCHES. | 3. CIRCUIT PATHS ARE FOR REFERENCE ONLY. | 4. HOLE SIZES SHOWN ARE FINISHED DIAMETERS AFTER PLATING. | 5. BOARD PLATED USING REFLOW OR SIMILAR METHOD. | 6. BOARD TO HAVE BLUE SOLDER MASK ON PLATED SURFACES USING WET FILM | 7. SILKSCREEN BOARD USING WHITE INK. | SR100 OR SR1010 EPOXY. EQUIVALENT WET OR DRY FILM MAY BE USED. | 8. THE FOLLOWING INFORMATION APPLIES TO THIS BOARD: | * 2 COPPER LAYERS | * .024 BOARD THICKNESS | * REQUIRES TOP SIDE SILKSCREEN | Thumby | AS-PCB-ASM4008 | 6